# EAGLE board watchplb_mainboard_v1_0 (EAGLE 6.5.0)
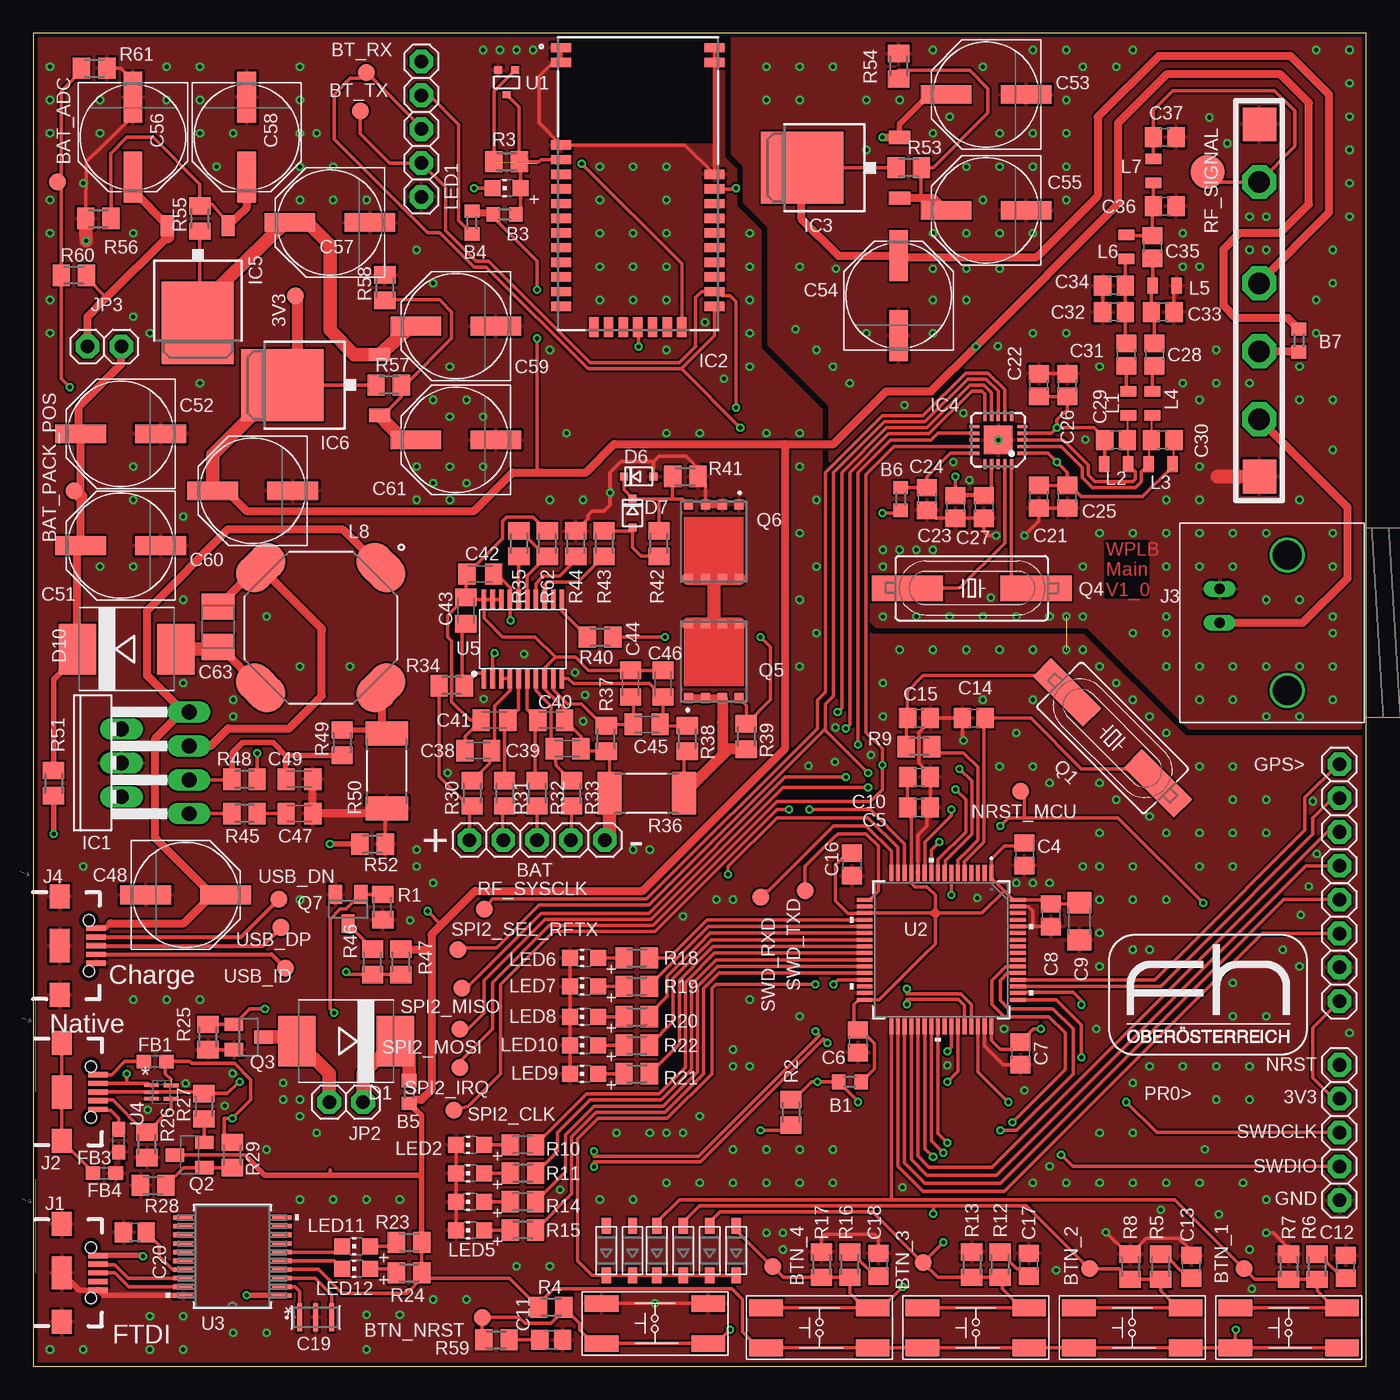
[diagram p8: board, top side]
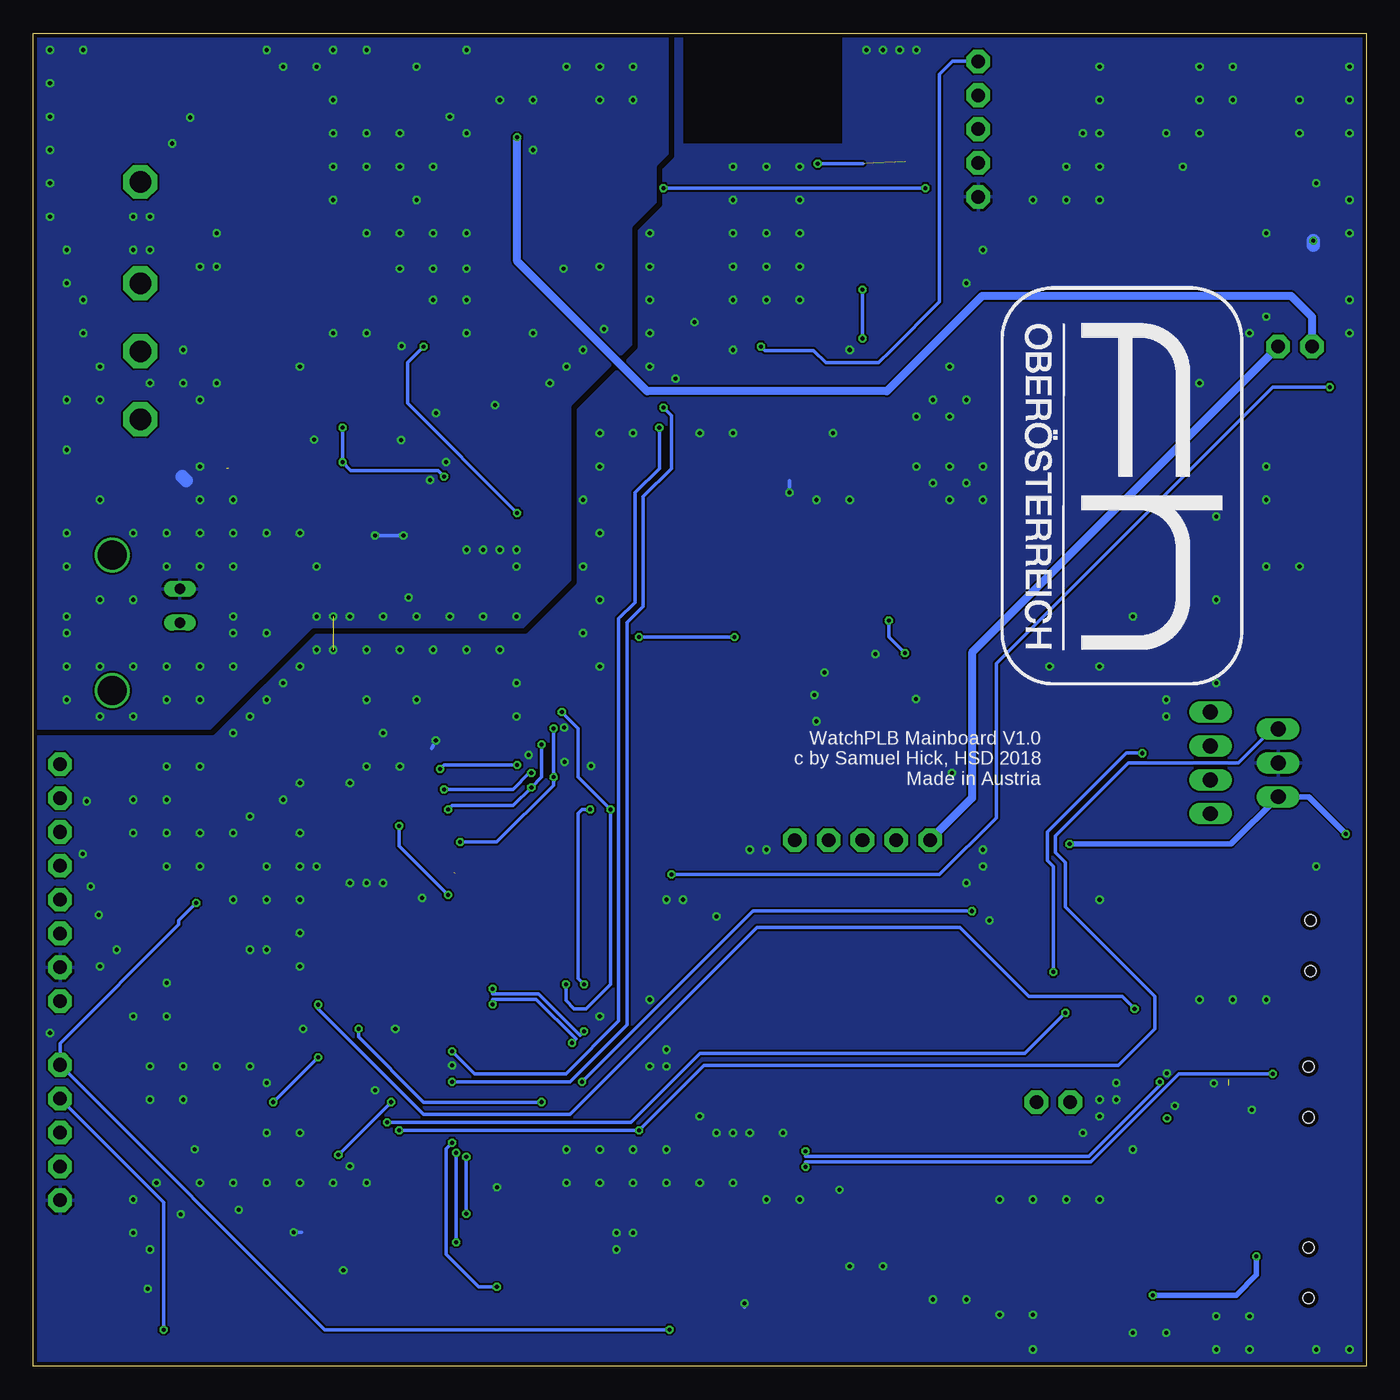
[diagram p9: board, bottom side, seen from below]

Size 100 x 100 mm. Coordinates in mm from the lower left corner, seen from the top.
Outline: 0,0 100,0 100,100 0,100 0,0
Copper layers (1*16): Top 0.035mm / dielectric 1.5mm / Bottom 0.035mm
Design rules "PCB-POOL Standard": minimum track width 0.15mm, minimum drill 0.3mm, track to track 0.15mm, track to pad 0.15mm, pad to pad 0.15mm, via to via 0.15mm, smd to smd 0.15mm, copper to edge 0.3mm, drill to drill 0.2mm, minimum pad ring 0.2mm, minimum via ring 0.15mm, stop-mask expansion 0.075mm, vias tented up to drill 0mil, thermal gap 0.2mm
tRestrict: area 39.3,91.7 to 51.2,99.7; 11 lines
bRestrict: area 39.3,91.7 to 51.2,99.7; 11 lines

## Footprints (pad centres in the part's own frame; a part is rotated, then mirrored left to right if it is on the bottom)
B1,27 = smd 1.27 x 1.27: TP 0,0
L0603 = smd 1 x 1.1: 1 -0.85,0; 2 0.85,0
1X05 = drill 1.016 pad 1.778 octagon: 1 -5.08,0; 2 -2.54,0; 3 0,0; 4 2.54,0; 5 5.08,0
C0805 = smd 1.3 x 1.5: 1 -0.85,0; 2 0.85,0
C1206 = smd 1.6 x 1.8: 1 -1.4,0; 2 1.4,0
CSTCE = smd 0.406 x 2.108: 1 -1.2,0; 2 0,0; 3 1.2,0
C0805K = smd 1.3 x 1.6: 1 -1,0; 2 1,0
PANASONIC_E = smd 3.8 x 1.4: + 3,0; - -3,0
B/3528-21R = smd 1.95 x 2.5: + 1.525,0; - -1.525,0
SMC = smd 2.8 x 3.8: A 3.7,0; C -3.7,0
SOD-123 = smd 1.2 x 0.7: A 1.85,0; C -1.85,0
SOD323-R = smd 0.6 x 0.6: A 1.1,0; C -1.1,0
0603 = smd 1.1 x 1: 1 -0.85,0; 2 0.85,0
1X08 = drill 1.016 pad 1.778 octagon: 1 -8.89,0; 2 -6.35,0; 3 -3.81,0; 4 -1.27,0; 5 1.27,0; 6 3.81,0; 7 6.35,0; 8 8.89,0
TO220-7 = drill 1.118 pad 1.626 long: 1 -3.81,-8.636; 2 -2.54,-3.556; 3 -1.27,-8.636; 4 0,-3.556; 5 1.27,-8.636; 6 2.54,-3.556; 7 3.81,-8.636
BM78SPPS5NC2_1 = smd 1.5 x 0.7: 1 -11.75,21.2; 2 -11.75,20.1; 3 -11.75,13.9; 4 -11.75,12.8; 5 -11.75,11.7; 6 -11.75,10.6; 7 -11.75,9.5; 8 -11.75,8.4; 9 -11.75,7.3; 10 -11.75,6.2; 11 -11.75,5.1; 12 -11.75,4; 13 -11.75,2.9; 14 -11.75,1.8; 22 -0.25,1.8; 23 -0.25,2.9; 24 -0.25,4; 25 -0.25,5.1; 26 -0.25,6.2; 27 -0.25,7.3; 28 -0.25,8.4; 29 -0.25,9.5; 30 -0.25,10.6; 31 -0.25,11.7; 32 -0.25,20.1; 33 -0.25,21.2 | smd 0.7 x 1.5: 15 -9.3,0.25; 16 -8.2,0.25; 17 -7.1,0.25; 18 -6,0.25; 19 -4.9,0.25; 20 -3.8,0.25; 21 -2.7,0.25
TO252 = smd 1 x 1.6: 1 -2.28,-4.8; 2 2.28,-4.8 | smd 5.4 x 6.2: TAB 0,2.5
QFN20 = smd 0.25 x 0.75: 1 -1,-1.8; 2 -0.5,-1.8; 3 0,-1.8; 4 0.5,-1.8; 5 1,-1.8; 11 1,1.8; 12 0.5,1.8; 13 0,1.8; 14 -0.5,1.8; 15 -1,1.8 | smd 0.75 x 0.25: 6 1.8,-1; 7 1.8,-0.5; 8 1.8,0; 9 1.8,0.5; 10 1.8,1; 16 -1.8,1; 17 -1.8,0.5; 18 -1.8,0; 19 -1.8,-0.5; 20 -1.8,-1 | smd 2.15 x 2.15: PAD 0,0
USB-B-MICRO-SMD = smd 1.45 x 0.4: D+ 2.725,0; D- 2.725,0.65; GND 2.725,-1.3; ID 2.725,-0.65; VBUS 2.725,1.3 | smd 1.5 x 1.8: SHIELD1 0,3.685; SHIELD2 0,-3.685 | smd 1.5 x 2.5: SHIELD3 0,0 | hole 0.85: 2.2,1.9; 2.2,-1.9
BNC = drill 2.2: 3 -5.08,5.08; 4 5.08,5.08 | drill 0.8 long: GND -2.54,0; S 0,0
1X02 = drill 1.016 pad 1.778 octagon: 1 -1.27,0; 2 1.27,0
0805 = smd 0.8 x 1.2: 1 -0.9,0; 2 0.9,0
INDM115115X635N = smd 2.769 x 4.064: 1 -6.375,0; 3 6.375,0 | smd 4.064 x 2.769: 2 0,-6.375; 4 0,6.375
CHIP-LED0805 = smd 1.2 x 1.2: A 0,-1.05; C 0,1.05
HC49UP = smd 5.334 x 1.93: 1 -4.826,0; 2 4.826,0
SOT23-BEC = smd 1 x 1.4: B -0.95,-1.1; C 0,1.1; E 0.95,-1.1
SOT23 = smd 1 x 1.4: 1 -0.95,-1.1; 2 0.95,-1.1; 3 0,1.1
TRANS_CSD18534Q5A = smd 0.75 x 0.68: 1 -2.77,1.905; 2 -2.77,0.635; 3 -2.77,-0.635; 4 -2.77,-1.905 | smd 0.66 x 0.68: 5 2.78,-1.905; 6 2.78,-0.635; 7 2.78,0.635; 8 2.78,1.905
M0805 = smd 1.3 x 1.6: 1 -0.95,0; 2 0.95,0
R2512 = smd 1.8 x 3.2: 1 -2.8,0; 2 2.8,0
B2,54 = smd 2.54 x 2.54: TP 0,0
SMD_SWITCH = smd 2.54 x 1.27: P$1 -4,1.5; P$2 4,1.5; P$3 -4,-1.5; P$4 4,-1.5
SC70-3-R = smd 0.6 x 0.55: 1 -0.65,-0.925; 2 0.65,-0.925; 3 0,0.925
LQFP64-10X10MM = smd 1.194 x 0.305: 1 -5.75,3.75; 2 -5.75,3.25; 3 -5.75,2.75; 4 -5.75,2.25; 5 -5.75,1.75; 6 -5.75,1.25; 7 -5.75,0.75; 8 -5.75,0.25; 9 -5.75,-0.25; 10 -5.75,-0.75; 11 -5.75,-1.25; 12 -5.75,-1.75; 13 -5.75,-2.25; 14 -5.75,-2.75; 15 -5.75,-3.25; 16 -5.75,-3.75; 33 5.75,-3.75; 34 5.75,-3.25; 35 5.75,-2.75; 36 5.75,-2.25; 37 5.75,-1.75; 38 5.75,-1.25; 39 5.75,-0.75; 40 5.75,-0.25; 41 5.75,0.25; 42 5.75,0.75; 43 5.75,1.25; 44 5.75,1.75; 45 5.75,2.25; 46 5.75,2.75; 47 5.75,3.25; 48 5.75,3.75 | smd 0.305 x 1.194: 17 -3.75,-5.75; 18 -3.25,-5.75; 19 -2.75,-5.75; 20 -2.25,-5.75; 21 -1.75,-5.75; 22 -1.25,-5.75; 23 -0.75,-5.75; 24 -0.25,-5.75; 25 0.25,-5.75; 26 0.75,-5.75; 27 1.25,-5.75; 28 1.75,-5.75; 29 2.25,-5.75; 30 2.75,-5.75; 31 3.25,-5.75; 32 3.75,-5.75; 49 3.75,5.75; 50 3.25,5.75; 51 2.75,5.75; 52 2.25,5.75; 53 1.75,5.75; 54 1.25,5.75; 55 0.75,5.75; 56 0.25,5.75; 57 -0.25,5.75; 58 -0.75,5.75; 59 -1.25,5.75; 60 -1.75,5.75; 61 -2.25,5.75; 62 -2.75,5.75; 63 -3.25,5.75; 64 -3.75,5.75
SSOP20_MC = smd 1.473 x 0.356: 1 -3.708,2.926; 2 -3.708,2.276; 3 -3.708,1.626; 4 -3.708,0.975; 5 -3.708,0.325; 6 -3.708,-0.325; 7 -3.708,-0.975; 8 -3.708,-1.626; 9 -3.708,-2.276; 10 -3.708,-2.926; 11 3.708,-2.926; 12 3.708,-2.276; 13 3.708,-1.626; 14 3.708,-0.975; 15 3.708,-0.325; 16 3.708,0.325; 17 3.708,0.975; 18 3.708,1.626; 19 3.708,2.276; 20 3.708,2.926
SOT50P160X60-5N = smd 1.118 x 0.254: 1 -0.737,0.508; 2 -0.737,0; 3 -0.737,-0.508 | smd 1.118 x 0.305: 4 0.737,-0.508; 5 0.737,0.508
TSSOP-20/6MM = smd 1.5 x 0.35: 1 -2.95,2.925; 2 -2.95,2.275; 3 -2.95,1.625; 4 -2.95,0.975; 5 -2.95,0.325; 6 -2.95,-0.325; 7 -2.95,-0.975; 8 -2.95,-1.625; 9 -2.95,-2.275; 10 -2.95,-2.925; 11 2.95,-2.925; 12 2.95,-2.275; 13 2.95,-1.625; 14 2.95,-0.975; 15 2.95,-0.325; 16 2.95,0.325; 17 2.95,0.975; 18 2.95,1.625; 19 2.95,2.275; 20 2.95,2.925
RA07H4047M = drill 1.6 pad 2.54 octagon: 1 6.1,1.75; 2 13.7,1.75; 3 18.8,1.75; 4 23.9,1.75 | smd 2.54 x 2.54: 5_L 1.778,1.778; 5_R 28.194,1.778

## Placement (x,y rotation side)
3V3  PTR1B1,27  [B1,27]  19.66,80.31 90 top
B1  BLM18KG601SN1D  [L0603]  61.26,21.34 0 top
B3  BLM18KG601SN1D  [L0603]  35.36,86.41 0 top
B4  BLM18KG601SN1D  [L0603]  32.92,85.8 270 top
B5  BLM18KG601SN1D  [L0603]  28.19,20.57 90 top
B6  BLM18KG601SN1D  [L0603]  65.07,65.07 90 top
B7  BLM18KG601SN1D  [L0603]  94.95,76.96 270 top
BAT  [1X05]  37.8,39.47 0 top
BAT_ADC  PTR1B1,27  [B1,27]  1.83,88.85 0 top
BAT_PACK_POS  PTR1B1,27  [B1,27]  3.05,65.68 0 top
BT_RX  PTR1B1,27  [B1,27]  24.99,97.08 0 top
BT_TX  PTR1B1,27  [B1,27]  24.54,94.18 0 top
BTN_1  PTR1B1,27  [B1,27]  90.83,7.32 180 top
BTN_2  PTR1B1,27  [B1,27]  79.25,7.32 180 top
BTN_3  PTR1B1,27  [B1,27]  66.75,7.77 180 top
BTN_4  PTR1B1,27  [B1,27]  55.47,7.47 180 top
BTN_NRST  PTR1B1,27  [B1,27]  33.68,3.66 180 top
C4  100nF  [C0805]  74.37,38.4 270 top
C5  100nF  [C0805]  66.45,41.91 180 top
C6  100nF  [C0805]  61.87,24.38 90 top
C7  100nF  [C0805]  74.07,23.47 270 top
C8  100nF  [C0805]  76.35,33.83 270 top
C9  10uF  [C1206]  78.49,33.38 270 top
C10  1uF  [C0805]  66.45,44.2 180 top
C11  100nF  [C0805]  38.86,1.98 180 top
C12  100nF  [C0805]  98.45,7.47 270 top
C13  100nF  [C0805]  86.87,7.47 270 top
C14  27p  [C0805]  70.56,48.62 180 top
C15  27p  [C0805]  66.45,48.62 0 top
C16  100nF  [C0805]  61.42,37.64 90 top
C17  100nF  [C0805]  74.68,7.62 270 top
C18  100nF  [C0805]  63.4,7.62 270 top
C19  CSTCE12M0G15L99-R0  [CSTCE]  21.18,3.66 0 top
C20  1uF  [C0805]  7.62,10.06 180 top
C21  100nF  [C0805]  75.44,65.23 90 top
C22  100nF  [C0805]  75.44,73.61 270 top
C23  100nF  [C0805]  69.19,64.47 90 top
C24  100nF  [C0805]  67.06,65.07 90 top
C25  27pF  [C0805]  77.57,65.23 90 top
C26  27pF  [C0805]  77.57,73.61 270 top
C27  1uF  [C0805]  71.32,64.47 90 top
C28  7.5pF  [C0805]  84.12,75.9 90 top
C29  2.7pF  [C0805]  81.23,69.49 180 top
C30  2.7pF  [C0805]  84.73,69.49 180 top
C31  7.5pF  [C0805]  81.99,75.9 90 top
C32  6pF  [C0805]  81.08,79.1 0 top
C33  6pF  [C0805]  84.73,79.1 0 top
C34  5.2pF  [C0805]  81.08,81.08 0 top
C35  5.2pF  [C0805]  83.97,83.97 270 top
C36  NC  [C0805]  84.89,87.02 180 top
C37  NC  [C0805]  84.89,92.2 180 top
C38  100nF  [C0805K]  33.38,46.18 180 top
C39  100nF  [C0805K]  40.08,46.33 0 top
C40  100nF  [C0805K]  38.86,48.46 0 top
C41  100nF  [C0805K]  34.59,48.46 180 top
C42  1uF  [C0805K]  33.53,59.44 0 top
C43  1uF  [C0805K]  32.46,56.69 90 top
C44  100nF  [C0805K]  44.81,51.21 270 top
C45  100nF  [C0805K]  46.02,48.16 0 top
C46  100nF  [C0805K]  47.24,51.21 90 top
C47  100nF  [C0805K]  19.96,41.45 180 top
C48  22uF 80-EDK226M050A9GAA  [PANASONIC_E]  11.43,35.36 0 top
C49  100nF  [C0805K]  19.96,44.04 180 top
C51  22uF 80-EDK226M050A9GAA  [PANASONIC_E]  6.55,61.57 180 top
C52  22uF 80-EDK226M050A9GAA  [PANASONIC_E]  6.55,69.95 180 top
C53  10uF 80-EDK106M025A9DAA  [PANASONIC_E]  71.48,95.4 180 top
C54  100uF 647-GYA1E101MCQ1GS  [PANASONIC_E]  64.92,80.31 90 top
C55  NP  [PANASONIC_E]  71.48,86.72 180 top
C56  10uF 80-EDK106M025A9DAA  [PANASONIC_E]  7.47,92.2 270 top
C57  100uF 647-GYA1E101MCQ1GS  [PANASONIC_E]  22.25,85.8 180 top
C58  NP  [PANASONIC_E]  16,92.2 270 top
C59  10uF 80-EDK106M025A9DAA  [PANASONIC_E]  31.7,78.03 180 top
C60  100uF 647-GYA1E101MCQ1GS  [PANASONIC_E]  16.46,65.68 180 top
C61  NP  [PANASONIC_E]  31.7,69.49 180 top
C63  4.7uF low esr 80-T521B475M35ATE150  [B/3528-21R]  13.87,55.47 90 top
CONFIG_INTERFACE_TEST_POINT  [1X05]  29.11,92.81 270 top
D1  S8NC-13  [SMC]  23.47,24.38 180 top
D2  [SOD-123]  46.79,8.69 90 top
D3  [SOD-123]  48.77,8.69 90 top
D4  [SOD-123]  50.75,8.69 90 top
D5  [SOD-123]  52.73,8.69 90 top
D6  Zener 16V MMSZ5246BS-7-F  [SOD323-R]  45.42,66.75 0 top
D7  100V, BAS16J,135  [SOD323-R]  44.96,64.01 270 top
D8  [SOD-123]  44.96,8.69 90 top
D9  [SOD-123]  42.98,8.69 90 top
D10  MBRS330T3  [SMC]  7.01,53.8 0 top
FB1  BLM18PG300SN1D  [0603]  9.14,22.86 0 top
FB3  BLM18PG300SN1D  [0603]  6.4,16.92 90 top
FB4  BLM18PG300SN1D  [0603]  5.33,14.48 180 top
GPS>  [1X08]  97.99,36.27 90 top
IC1  LT1513  [TO220-7]  3.05,45.26 90 top
IC2  BM70BLES1FC2-0B03AA  [BM78SPPS5NC2_1]  51.36,77.72 0 top
IC3  LM1117DTX-ADJ-12V  [TO252]  60.2,89.92 90 top
IC4  AX5031  [QFN20]  72.39,69.49 90 top
IC5  LM1117DTX-ADJ-10V  [TO252]  12.34,80.77 180 top
IC6  LM1117DTX-ADJ-3V3  [TO252]  21.18,73.61 90 top
J1  [USB-B-MICRO-SMD]  2.13,7.01 0 top
J2  [USB-B-MICRO-SMD]  2.13,20.57 0 top
J3  BNCPTH  [BNC]  89,55.78 270 top
J4  [USB-B-MICRO-SMD]  1.98,31.55 0 top
JP2  VIB_MOTOR, 619-28821  [1X02]  23.47,19.81 180 top
JP3  Power Disconnect  [1X02]  5.33,76.5 180 top
L1  39nH  [0805]  82.14,72.24 270 top
L2  120nH  [0805]  81.23,67.67 0 top
L3  120nH  [0805]  84.58,67.67 0 top
L4  39nH  [0805]  83.97,72.24 270 top
L5  27nH  [0805]  84.89,81.08 180 top
L6  27nH  [0805]  81.99,83.97 90 top
L7  0R  [0805]  84.05,89.69 90 top
L8  CTX10-4A-R  [INDM115115X635N]  21.57,55.4 225 top
LED1  BLUE  [CHIP-LED0805]  35.51,88.39 90 top
LED2  GREEN  [CHIP-LED0805]  32.77,16.61 90 top
LED3  BLUE  [CHIP-LED0805]  32.77,14.48 90 top
LED4  WHITE  [CHIP-LED0805]  32.77,12.34 90 top
LED5  RED  [CHIP-LED0805]  32.77,10.21 90 top
LED6  GREEN  [CHIP-LED0805]  41.3,30.63 90 top
LED7  GREEN  [CHIP-LED0805]  41.3,28.5 90 top
LED8  GREEN  [CHIP-LED0805]  41.3,26.21 90 top
LED9  RED  [CHIP-LED0805]  41.3,21.95 90 top
LED10  YELLOW  [CHIP-LED0805]  41.3,24.08 90 top
LED11  GREEN  [CHIP-LED0805]  24.23,8.99 90 top
LED12  RED  [CHIP-LED0805]  24.23,7.32 90 top
NRST_MCU  PTR1B1,27  [B1,27]  74.07,43.13 180 top
PR0>  SWD  [1X05]  97.99,17.53 90 top
Q1  8MHz / LFXTAL020423Reel  [HC49UP]  80.97,47.14 315 top
Q2  BC817-25SMD  [SOT23-BEC]  11.73,15.85 90 top
Q3  DMN3023L-7  [SOT23]  16.15,24.69 270 top
Q4  16MHz_LFXTAL051370Reel  [HC49UP]  70.41,58.37 180 top
Q5  CSD18534Q5A  [TRANS_CSD18534Q5A]  51.05,52.88 90 top
Q6  CSD18534Q5A  [TRANS_CSD18534Q5A]  51.05,61.87 270 top
Q7  DMN3023L-7  [SOT23]  23.62,34.29 180 top
R1  100k  [M0805]  26.21,34.44 270 top
R2  100k  [M0805]  56.85,19.05 90 top
R3  4k7  [M0805]  35.51,90.37 180 top
R4  47k  [M0805]  38.86,4.42 0 top
R5  10k  [M0805]  84.58,7.47 270 top
R6  10k  [M0805]  96.32,7.47 270 top
R7  10k  [M0805]  94.18,7.47 90 top
R8  10k  [M0805]  82.3,7.47 90 top
R9  220R  [M0805]  66.45,46.48 0 top
R10  470R  [M0805]  36.73,16.61 0 top
R11  470R  [M0805]  36.73,14.48 0 top
R12  10k  [M0805]  72.54,7.62 270 top
R13  10k  [M0805]  70.41,7.62 90 top
R14  470R  [M0805]  36.73,12.34 0 top
R15  470R  [M0805]  36.73,10.21 0 top
R16  10k  [M0805]  61.26,7.62 270 top
R17  10k  [M0805]  59.13,7.62 90 top
R18  470R  [M0805]  45.26,30.63 180 top
R19  470R  [M0805]  45.26,28.5 180 top
R20  470R  [M0805]  45.26,26.21 180 top
R21  470R  [M0805]  45.26,21.95 180 top
R22  470R  [M0805]  45.26,24.08 180 top
R23  470R  [M0805]  28.19,9.3 180 top
R24  470R  [M0805]  28.19,7.01 180 top
R25  100k  [M0805]  13.11,24.69 270 top
R26  100k  [M0805]  8.53,16.61 270 top
R27  x  [M0805]  12.8,19.51 90 top
R28  x  [M0805]  8.99,13.56 180 top
R29  x  [M0805]  14.94,15.85 270 top
R30  1k  [M0805]  32.92,42.98 90 top
R31  1k  [M0805]  35.36,42.98 90 top
R32  1k  [M0805]  37.8,42.98 90 top
R33  1k  [M0805]  40.39,42.98 90 top
R34  1k  [M0805]  31.39,51.05 0 top
R35  10k  [M0805]  36.42,61.72 90 top
R36  20mR  [R2512]  46.02,42.98 180 top
R37  100R  [M0805]  42.98,47.09 270 top
R38  100R  [M0805]  49.07,47.09 270 top
R39  10M  [M0805]  53.49,47.24 270 top
R40  5k1  [M0805]  42.52,54.71 180 top
R41  3M3  [M0805]  48.92,66.75 180 top
R42  1M  [M0805]  46.94,61.72 270 top
R43  5k1  [M0805]  42.82,61.72 90 top
R44  470k  [M0805]  40.69,61.72 90 top
R45  330  [M0805]  15.85,41.45 0 top
R46  910R  [M0805]  25.45,30.33 270 top
R47  10k  [M0805]  27.58,30.33 270 top
R48  330k  [M0805]  15.85,44.04 180 top
R49  3k9  [M0805]  23.16,46.79 90 top
R50  0.25R  [R2512]  26.52,44.65 90 top
R51  155k  [M0805]  1.52,43.74 90 top
R52  12k4  [M0805]  25.45,39.17 180 top
R53  5k1  [M0805]  65.68,89.92 0 top
R54  39k  [M0805]  64.92,97.54 90 top
R55  33k  [M0805]  12.5,86.11 90 top
R56  5k1  [M0805]  4.88,86.11 180 top
R57  8k2  [M0805]  26.67,73.61 0 top
R58  5k1  [M0805]  26.37,80.92 90 top
R59  10k  [M0805]  34.75,1.98 180 top
R60  47k  [M0805]  3.05,81.84 0 top
R61  10k  [M0805]  4.57,97.38 180 top
R62  NTC 103AT  [M0805]  38.56,61.72 90 top
RF_SIGNAL  PTR1B2,54  [B2,54]  88.09,89.61 0 top
RF_SYSCLK  PTR1B1,27  [B1,27]  33.83,34.29 180 top
S1  [SMD_SWITCH]  46.63,3.2 180 top
S2  [SMD_SWITCH]  94.18,2.9 180 top
S3  [SMD_SWITCH]  82.45,2.9 180 top
S4  [SMD_SWITCH]  70.71,2.9 180 top
S5  [SMD_SWITCH]  58.98,2.9 180 top
SPI2_CLK  PTR1B1,27  [B1,27]  31.55,19.2 180 top
SPI2_IRQ  PTR1B1,27  [B1,27]  32,22.4 180 top
SPI2_MISO  PTR1B1,27  [B1,27]  32.16,28.35 180 top
SPI2_MOSI  PTR1B1,27  [B1,27]  32,25.3 180 top
SPI2_SEL_RFTX  PTR1B1,27  [B1,27]  31.85,31.24 180 top
SWD_RXD  PTR1B1,27  [B1,27]  54.56,35.2 180 top
SWD_TXD  PTR1B1,27  [B1,27]  57.91,35.66 180 top
U1  MCP111-XXXXX/TOSMD  [SC70-3-R]  35.51,96.32 180 top
U2  STM32L073RZ  [LQFP64-10X10MM]  68.12,31.24 270 top
U3  MCP2200-I/SS  [SSOP20_MC]  14.94,8.23 180 top
U4  TPD3E001DRLR  [SOT50P160X60-5N]  9.6,20.57 0 top
U5  BQ7790504  [TSSOP-20/6MM]  36.73,54.56 90 top
U$2  RA07H4047M  [RA07H4047M]  90.22,94.95 270 top
U$4  [FH_LOGO]  27.74,81.38 270 bottom
U$5  [FH_LOGO_050]  80.47,23.16 0 top
USB_DN  PTR1B1,27  [B1,27]  18.44,35.05 90 top
USB_DP  PTR1B1,27  [B1,27]  18.59,32.92 90 top
USB_ID  PTR1B1,27  [B1,27]  18.9,29.87 90 top

## Tracks (layer width: path | path; a pad name or v marks a point on that pad's centre or on a via)
10V_INTERMEDIATE
  Top 0.254: R55.1 12.5,78.33 IC5.TAB
  Top 0.813: C57.+ 19.4,85.65 20.73,85.65
  Top 1.016: C57.+ 18.9,85.8 13.11,80.16 13.11,78.94 IC5.TAB | C59.+ 28.35,78.03 IC6.2 24.09,75.89 22.25,77.72 22.25,84.12 20.73,85.65
+3V3  (via drill 0.3)
  Top 0.254: R57.1 19.81,73.61 IC6.TAB | Q2.C 15.85,15.85 16.15,15.54 | B6.1 64.86,64.01 v63.7,64.01 | B3.1 33.16,86.41 B4.1 34.05,86.65 37.8,82.91 v37.8,80.77 | R23.1 R24.1 29.14,6.59 | U3.4 21.4,7.25 23.16,5.49 28.04,5.49 29.14,6.59 | 29.14,6.59 35.74,6.59 R4.1 37.91,4.69 39.01,5.79 52.43,5.79 53.19,5.03 53.19,2.59 54.38,1.4 S5.P$2 S5.P$1 S4.P$2 S4.P$1 S3.P$2 S3.P$1 S2.P$2 | v29.57,34.14 30.6,33.11 | v61.87,19.81 61.57,20.18 B1.1 v58.83,21.34 58.37,21.34 58.22,21.18 57.03,20 R2.2 | v37.8,77.11 37.8,67.36 38.1,67.06 | v75.59,25.3 75.05,25.3 C7.1 74,24.32 73.46,23.77 72.54,23.77 71.87,24.44 U2.48 | GPS>.1 96.01,25.4 96.01,21.64 97.59,20.07 PR0>.4 | S2.P$1 S2.P$2 | v90.22,2.74 90.18,2.71 S2.P$2 | 22.25,14.75 22.25,14.33
  Top 0.406: B5.1 29.14,18.77 29.14,14.33 | 29.14,14.33 R23.1 | 16.15,15.54 17.37,14.33 22.25,14.33 29.14,14.33
  Top 0.61: B7.1 94.12,78.64 90.22,78.64 89.31,79.55 89.31,83.82 90.53,85.04 93.57,85.04 95.71,87.17 95.71,94.79 93.57,96.93 85.04,96.93 81.38,93.27 81.38,87.17 v70.71,76.5 | v70.71,76.5 70.41,76.2 | C60.+ 13.61,65.53 14.63,65.53 16,64.16 33.07,64.16 35.97,67.06 38.1,67.06 41.45,67.06 43.59,69.19 56.39,69.19 | v70.71,76.5 67.36,73.15 64.01,73.15 60.05,69.19 56.39,69.19 | 56.39,69.19 56.39,46.33 45.72,35.66 33.15,35.66 30.6,33.11 29.87,32.38 29.87,31.24 | 29.87,31.24 29.87,20.73 29.11,19.96 28.65,19.96 28.41,19.72 B5.1 | R47.1 29.84,31.28 29.87,31.24
  Top 0.813: 3V3.TP 19.81,80.16 19.81,73.61
  Top 1.016: C60.+ 13.46,68.39 IC6.TAB
  Bottom 0.254: v63.7,64.01 71.93,72.24 71.93,75.29 v70.71,76.5 | v29.57,34.14 46.02,34.14 v58.83,21.34 | v61.87,19.81 70.71,19.81 75.59,24.69 v75.59,25.3 | v37.8,80.77 v37.8,77.11 | PR0>.4 93.57,15.65 90.22,12.29 v90.22,2.74
+12V
  Top 0.254: R53.1 IC3.TAB
  Top 0.61: 64.92,83.36 C54.+ 60.4,83.31 57.61,86.11 57.61,87.33 59.59,89.31 | 91.97,81.3 97.23,86.56 97.23,95.4 94.34,98.3 84.43,98.3 79.86,93.73 79.86,87.78 75.29,83.21 65.08,83.21 64.92,83.36 | 64.92,83.97 64.92,83.36
  Top 1.016: 59.59,89.31 58.37,89.31 IC3.TAB | U$2.2 91.97,81.3
ANT_N
  Top 0.15: L1.2 82.08,71.27 C29.1 82.13,69.44 L2.2
  Top 0.254: IC4.3 77.28,69.49 79.17,67.61 79.17,66.85 79.65,66.37 82.51,66.37 82.68,66.54 82.68,67.12 L2.2
ANT_P
  Top 0.15: L4.2 83.88,71.25 C30.2 83.68,69.29 L3.1
  Top 0.254: IC4.2 77.14,68.99 78.72,67.42 78.72,66.66 79.46,65.91 82.69,65.91 83.13,66.35 83.13,67.12 L3.1
BAT_ADC  (via drill 0.3)
  Top 0.254: 2.1,89 R60.1 2.1,74.1 v2.74,73.46 | 2.1,89 2.1,95.67 3.35,96.93 3.35,97.11 R61.2 | BAT_ADC.TP 1.95,88.85 2.1,89 | U2.15 64.87,38.91 62.64,41.15 55.78,41.15 52.12,37.49 v52.12,36.88
  Bottom 0.254: v2.74,73.46 7.01,73.46 27.74,52.73 27.74,41.15 32,36.88 v52.12,36.88
BAT_PACK_GND
  Top 0.254: 32.16,46.18 C38.2 32.38,47.24 C41.2 32.77,48.46 31.39,49.84 31.39,54.41 31.09,54.71 31.09,56.32 C43.2 | U5.20 U5.19 U5.18 | R36.2 43.23,45.89 R37.2 41.27,46.14 C39.2 41.08,47.24 C40.2 39.93,48.53 39.93,49.23 38.35,50.8 U5.8 38.35,52.37 39.17,53.19 | C46.2 C44.1 41.67,52.21 40.69,53.19 39.17,53.19 | R62.2 38.56,62.94 38.25,62.94 37.49,63.7 35.51,63.7 35.2,63.4 35.2,62.11 C42.1 32.46,59.37 C43.2 | U5.20 32.65,57.51 C43.2 | 39.17,53.19 37.64,54.71 35.2,54.71 33.8,56.11 U5.20
  Top 1.016: R36.2 43.23,39.82 BAT.5
BAT_PACK_POS
  Top 0.254: BAT.1 32.72,41.82 R30.1 32.73,42.22 32.46,42.22 30.44,44.23 R34.1
  Top 0.406: R51.2 1.52,51.51 3.05,53.03 3.05,53.53 D10.C
  Top 0.61: D10.C 3.31,61.33 | C51.+ 3.55,65.23 C52.+ | 3.4,70.15 3.4,71.98 6.6,75.18 JP3.1
  Top 1.016: 3.31,61.33 C51.+ | C52.+ 3.4,70.1 | 3.4,70.1 2.13,70.1 | 3.4,70.1 3.4,70.15 | BAT_PACK_POS.TP 3.1,65.68 3.55,65.23
  Bottom 0.61: BAT.1 29.57,42.62 29.57,53.54 JP3.1
BT_HCI_RXD  (via drill 0.3)
  Top 0.254: IC2.22 51.11,77.32 48.62,74.83 | 48.62,74.83 41.6,74.83 33.98,82.45 33.07,82.45 30.48,85.04 29.57,85.04 22.55,92.05 22.55,95.4 23.77,96.62 24.54,96.62 BT_RX.TP 29.11,92.96 CONFIG_INTERFACE_TEST_POINT.3 | 48.62,74.83 v53.03,70.41 | U2.42 68.89,25.48 68.89,23.93 v68.58,23.62
  Bottom 0.254: v53.03,70.41 53.03,67.36 54.86,65.53 54.86,57.3 56.08,56.08 56.08,25.91 60.05,21.95 66.9,21.95 v68.58,23.62
BT_HCI_TXD  (via drill 0.3)
  Top 0.254: v52.73,71.93 52.73,79.86 52.27,80.31 51.66,80.31 51.35,80.62 IC2.23 50.14,80.62 49.68,80.16 49.68,76.5 48.46,75.29 41.76,75.29 34.14,82.91 33.22,82.91 30.94,85.19 30.94,88.44 CONFIG_INTERFACE_TEST_POINT.4 26.72,90.27 24.54,92.46 BT_TX.TP | U2.43 69.37,22.13 v68.58,21.34
  Bottom 0.254: v52.73,71.93 52.12,71.32 52.12,67.36 54.25,65.23 54.25,57 55.47,55.78 55.47,25.6 59.74,21.34 v68.58,21.34
BT_NRST  (via drill 0.3)  (1 unrouted)
  Top 0.254: R3.2 34.56,93.41 34.56,95.67 34.9,96.01 35.23,96.32 U1.1 | IC2.21 48.66,82.71 v41.15,90.22
  Bottom 0.254: v41.15,90.22 37.74,90.22
BT_P2_0_MODE  (via drill 0.3)
  Top 0.254: v45.41,76.5 45.41,77.92 IC2.18
  Bottom 0.254: CONFIG_INTERFACE_TEST_POINT.1 31.04,97.89 32,96.93 32,85.65 32,79.86 35.66,76.2 36.58,75.29 40.54,75.29 41.45,76.2 45.11,76.2 v45.41,76.5
BTN_1
  Top 0.254: D2.A 46.79,10.82 48.46,12.5 64.31,12.5 | 64.31,12.5 85.65,12.5 BTN_1.TP 91.63,6.52 R7.1 R6.2 96.32,5.64 97.56,4.4 S2.P$3 S2.P$4 | U2.33 64.37,12.56 64.31,12.5
BTN_2  (via drill 0.3)
  Top 0.254: D3.A 48.77,10.82 49.99,12.04 67.51,12.04 | 67.51,12.04 74.52,12.04 BTN_2.TP 81.5,7.32 R8.1 R5.2 84.58,5.64 85.83,4.4 S3.P$3 S3.P$4 | U2.38 66.9,25.46 66.9,16.31 v67.51,15.7 | v67.51,11.43 67.51,12.04
  Bottom 0.254: v67.51,15.7 v67.51,11.43
BTN_3  (via drill 0.3)
  Top 0.254: BTN_3.TP 67.85,6.67 R13.1 R12.2 72.69,6.52 72.69,5.79 74.09,4.4 S4.P$3 S4.P$4 | 50.77,10.54 D4.A 50.9,10.69 50.9,10.97 51.51,11.58 62.94,11.58 BTN_3.TP | U2.39 67.37,16.9 v68.28,16 | v68.28,9.3 BTN_3.TP
  Bottom 0.254: v68.28,16 v68.28,9.3
BTN_4  (via drill 0.3)
  Top 0.254: D5.A 52.73,10.21 BTN_4.TP 56.27,6.67 R17.1 R16.2 61.27,5.79 61.27,5.49 61.42,5.33 62.36,4.4 S5.P$3 | U2.40 67.87,17.47 v68.58,16.76 | S5.P$3 63.68,4.4 v65.23,5.94 | S5.P$4 S5.P$3
  Bottom 0.254: v68.58,16.76 69.04,16.31 69.04,8.38 66.6,5.94 v65.23,5.94
CHARGER_CH_PRECH  (via drill 0.3)
  Top 0.254: U2.54 72.97,29.99 71.93,28.96 71.93,27.13 72.85,26.21 76.2,26.21 77.42,24.99 77.42,22.25 v73.46,18.29 | v22.55,26.52 22.25,26.82 22.25,32.16 22.25,33.53 23.01,34.29 23.47,34.29 Q7.1 R1.1
  Bottom 0.254: v22.55,26.52 25.6,23.47 49.68,23.47 49.99,23.47 55.17,18.29 v73.46,18.29
CHARGER_SS  (via drill 0.3)
  Top 0.254: U2.53 73.08,29.49 72.54,28.96 72.54,27.43 73.15,26.82 76.5,26.82 78.03,25.3 78.03,21.95 73.76,17.68 v72.54,17.68 | R2.1 56.42,17.68 v54.56,17.68
  Bottom 0.254: IC1.6 7.06,47.8 9.6,45.26 17.83,45.26 23.32,39.78 23.32,38.56 22.55,37.8 22.55,34.44 15.85,27.74 15.85,25.3 18.59,22.55 49.68,22.55 v54.56,17.68 v72.54,17.68
GND  (via drill 0.3)  (1 unrouted)
  Top 0.254: R56.2 3.96,90.37 7.47,93.73 C56.- 7.01,95.66 7.01,96.93 6.55,97.38 R61.1 | C59.- 33.38,78.03 | 39.99,1.7 C11.1 | C13.1 86.87,8.69 85.95,9.6 83.52,9.6 82.33,8.42 R8.2 82.11,8.42 v80.47,10.06 | R25.2 Q3.2 | Q6.3 50.42,66.2 R41.1 50.17,67.05 48.95,68.28 46.94,68.28 46.52,67.85 | R44.2 41.6,63.59 41.6,63.86 41.91,64.16 42.82,64.16 43.28,64.62 v43.28,65.53 43.28,67.06 44.08,67.85 46.52,67.85 | R52.1 26.4,41.17 26.12,41.45 | C26.1 C22.1 | v74.37,62.33 75.44,63.4 C21.1 C25.1 | 85.48,79.5 C33.2 85.58,80.87 L5.1 | C34.1 C32.1 | 46.52,67.85 D6.A | 26.36,81.84 R58.2 | IC2.1 IC2.2 39.59,97.84 39.01,97.84 37.95,96.77 37.95,93.28 IC2.3 48.91,91.62 IC2.31 IC2.32 IC2.33 | 21.18,2.9 C19.2 | U2.60 74.98,32.99 | 74.98,32.99 76.34,32.99 C8.2 | U2.63 74.63,34.49 74.98,34.14 74.98,32.99 | C7.2 72.78,22.62 71.37,24.03 U2.47 | U2.12 66.37,39.85 67.06,40.54 67.06,41.06 C5.1 67.3,44.41 66.45,45.26 66.45,47.55 66.9,48.01 66.9,48.22 C15.2 C14.2 69.71,47.03 v69.8,46.94 | LED9.C LED10.C LED8.C LED7.C LED6.C | LED2.C LED3.C LED4.C LED5.C | R7.2 94.18,8.84 93.02,10 v92.5,10 | U4.3 8.48,20.07 | C18.1 63.4,9.6 63.09,9.91 59.44,9.91 59.13,9.6 R17.2 | C24.1 67.67,63.62 C23.1 C27.1 71.32,62.64 71.63,62.33 v72.24,62.33 | S1.P$3 46.66,4.7 v46.63,4.72 46.61,4.7 S1.P$4
  Top 0.406: J1.SHIELD3 3.43,5.71 J1.GND 5.26,5.3 U3.20
  Top 0.61: Q6.2 Q6.3 | C49.1 C47.1 26.12,41.45 | C52.- 10.52,69.95
  Top 1.016: 8.84,61.57 C51.- | R50.1 26.12,41.45 | U$2.5_R 88.85,66.75 | R56.2 3.93,85.08 v3.96,84.43
  Bottom 0.254: v72.24,62.33 v74.37,62.33 | v69.8,46.94 70.1,46.33 | v80.47,10.06 79.86,10.06 | v43.28,65.53 43.28,66.45 | v46.63,4.72 46.63,4.42
  Bottom 1.016: 88.85,66.75 88.54,66.45 | v3.96,84.43 3.96,84.12
  other vias: 72.39,69.49 84.58,11.73 88.93,11.4 90.76,13.75 87.5,13.75 85,13.75 82.5,13.75 80,13.75 77.5,13.75 76.25,15 75,13.75 91.25,8.75 92.5,12.5 80,17.5 82.5,17.5 87.9,16.28 88.75,20 88.75,22.5 86.25,22.5 83.75,22.5 82.5,21.25 91.25,20 91.25,22.5 98.75,25 80,30 82.5,31.25 83.75,31.25 93.75,31.25 92.5,26.25 90,26.25 90,28.75 95,30 80,32.5 85,35 82.5,35 80,35 82.5,37.5 80,40 80,37.5 78.75,37.5 76.25,36.25 75,36.25 73.75,36.25 90,45 90,42.5 92.5,42.5 90,40 92.5,40 90,37.5 87.5,37.5 85,40 87.5,40 87.5,45 85,47.5 83.75,48.75 82.5,50 81.25,51.25 80,52.5 78.75,53.75 77.5,53.75 75,53.75 75,50 71.25,50 73.75,47.5 72.5,45 75,45 76.25,43.75 80,43.75 81.25,42.5 83.75,41.25 72.5,53.75 70,53.75 67.5,53.75 65,53.75 63.75,51.25 63.75,48.75 97.5,56.25 97.5,55 97.5,52.5 97.5,50 95,48.75 92.5,48.75 85,55 85,52.5 92.5,52.5 95,52.5 82.5,55 77.5,56.25 78.75,56.25 85,56.25 85,60 87.5,60 90,60 92.5,57.5 95,57.5 97.5,60 97.5,62.5 95,65 92.5,62.5 90,62.5 85,62.5 87.5,62.5 82.5,62.5 80,62.5 78.75,60 85,65 87.5,65 87.5,67.5 90,50 90,52.5 87.5,50 87.5,52.5 76.25,56.25 73.75,56.25 71.25,56.25 71.83,57.68 68.75,56.25 66.25,56.25 63.75,56.25 63.75,60 63.75,61.25 67.5,61.25 66.25,61.25 65,61.25 87.5,72.5 88.75,73.75 86.25,73.75 97.5,68.75 97.5,72.5 96.25,77.5 96.25,80 97.5,81.25 97.5,83.75 95,75 95,72.5 91.25,73.75 88.75,76.25 87.5,82.5 86.25,82.5 86.25,85 91.25,86.25 92.5,86.25 92.5,83.75 91.25,83.75 98.75,86.25 98.75,88.75 98.75,91.25 98.75,93.75 98.75,96.25 98.75,98.75 96.25,98.75 82.5,98.75 77.5,98.75 78.75,97.5 81.25,97.5 77.5,95 77.5,90 77.5,92.5 77.5,87.5 75,98.75 71.25,97.5 67.5,98.75 71.25,87.5 70,90 75,92.5 75,90 72.5,92.5 72.5,90 70,85 75,85 72.5,85 67.5,85 70,82.35 72.5,82.35 70,80 67.5,77.5 67.5,80 67.5,82.35 60.21,82.35 62.5,77.5 61.25,73.75 60,75 58.75,76.25 57.2,77.8 57.5,82.5 60,97.5 57.5,95 57.5,97.5 55,97.5 55,95 62.5,95 65,95 67.5,92.5 68.75,93.75 62.5,91.25 53.75,85 53.75,82.5 53.75,80 53.75,77.5 53.75,75 55,70 57.5,70 57.5,67.5 58.75,65 57.5,62.5 58.75,60 57.5,57.5 58.75,55 57.5,52.5 75,77.5 77.5,77.5 80,75 50,70 47.5,70 40,70 38.75,76.25 47.5,76.25 47.5,80 45,80 42.5,80 42.5,87.5 42.5,85 42.5,82.5 47.5,82.5 45,82.5 45,85 47.5,87.5 47.5,85 47.5,90 45,90 42.5,90 37.5,98.75 36.25,98.75 35,98.75 33.75,98.75 20,97.5 20,95 20,92.5 21.25,92.5 22.5,90 25,87.5 22.5,87.5 20,87.5 20,90 15,92.5 13.75,90 12.5,97.5 12.5,95 12.5,92.5 10,97.5 10,95 1.25,97.5 5,95 5,92.5 3.75,88.75 1.25,95 1.25,92.5 1.25,87.5 1.25,85 7.5,85 7.5,78.75 8.75,77.5 1.25,77.5 1.25,80 7.5,67.5 7.5,65 7.5,60 5,60 12.5,73.75 60,16.25 60,13.75 57.5,16.25 57.5,13.75 55,16.25 55,13.75 52.5,16.25 52.5,13.75 50,13.75 47.5,13.75 42.5,12.5 45,12.5 56.25,10 56.25,8.75 55,10 38.75,7.5 36.25,7.5 32.5,5 30,5 27.5,3.87 25,3.87 25,1.25 17.5,2.5 15,2.5 11.25,3.75 8.75,3.75 11.25,1.25 8.75,1.25 3.75,1.25 1.25,1.25 20,12.5 22.5,12.5 25,12.5 27.5,12.5 17.5,16.25 18.75,20 18.75,21.25 20,20 20,18.75 21.25,17.5 7.5,27.5 10,27.5 12.5,27.5 3.75,37.5 20,35 28.75,37.5 30,36.25 28.26,33.45 28.75,38.75 38.75,65 41.25,65 28.75,65 33.75,67.5 32.5,66.25 31.25,65 30,66.25 31.25,67.5 28.75,67.5 33.75,71.25 31.25,71.25 30,72.5 32.5,72.5 31.25,75 28.75,83.75 30,81.25 15,48.75 15,50 11.25,51.25 20,52.5 11.25,57.5 17.5,56.25 23.75,52.5 11.25,63.75 43.75,17.5 39.51,13.23 46.25,17.5 47.5,17.5 48.75,17.5 50,18.75 53.75,22.5 52.5,23.75 52.5,22.5 53.75,27.5 57.5,26.25 52.5,35 51.25,35 48.75,33.75 46.25,38.75 45,38.75 8.57,19.24 11.43,21.22 14.94,21.98 76.74,7.2 74.36,20.7 88.23,93.69 89.57,91.74 14.36,19.54 36.83,53.42 58.17,45.04 60.15,45.34 70.82,35.13 33.78,50.06 41.4,50.37 41.25,48.39 40.64,52.05 79.76,25.31 91.43,5.79 72.38,76.52 78.93,69.51 70.25,66.47 69.03,67.84 69.79,71.49 65.37,72.1 51.81,74.09 95.09,33.85 95.7,35.99 96.31,38.42 96,42.39 65.22,13.43 68.57,22.57 72.84,25.32 31.08,44.52 62.84,45.85 60.17,47.91 50.4,78.32
  pour Bottom: 0,100 100,100 100.61,0 0,0
  pour Top: 0,100 100,100 101.52,-0.15 0.3,0
GPS_EXTINT
  Top 0.254: GPS>.5 95.45,37.54 72.24,14.33 67.06,14.33 65.87,15.51 U2.36
GPS_NRESET
  Top 0.254: GPS>.6 97.08,40.08 71.93,14.94 67.21,14.94 66.37,15.77 U2.37
GPS_RXD
  Top 0.254: U2.51 84.58,28.49 87.17,31.09 96.01,39.93 96.01,41.15 97.48,42.62 GPS>.7
GPS_SCL
  Top 0.254: GPS>.3 92.2,32.46 72.85,13.11 66.75,13.11 64.87,14.98 U2.34
GPS_SDA
  Top 0.254: GPS>.4 93.83,35 72.54,13.72 66.9,13.72 65.37,15.25 U2.35
GPS_TXD
  Top 0.254: U2.52 84.16,28.99 86.56,31.39 95.4,40.23 95.4,42.67 97.89,45.16 GPS>.8
IND_LED_B
  Top 0.254: U2.26 51.22,30.49 49.68,28.96 49.38,28.65 49.38,24.38 49.38,22.25 47.24,20.12 47.09,19.96 41.76,19.96 39.32,17.53 39.32,16.12 R11.2
IND_LED_G
  Top 0.254: U2.25 51.11,30.99 49.07,28.96 48.92,28.8 48.92,24.38 48.92,22.4 46.94,20.42 41.49,20.42 R10.2
IND_LED_R
  Top 0.254: U2.28 51.44,29.49 50.29,28.35 50.29,24.38 50.29,22.1 50.29,21.95 47.4,19.05 42.22,19.05 40.39,17.22 40.39,12.92 R15.2
IND_LED_W
  Top 0.254: U2.27 51.33,29.99 49.99,28.65 49.84,28.5 49.84,24.38 49.84,22.1 47.55,19.81 47.24,19.51 42.06,19.51 39.93,17.37 39.93,14.6 R14.2
INT_POWER  (via drill 0.3)  (1 unrouted)
  Top 0.15: L3.2 85.58,67.77 C30.1 | C29.2 80.33,69.44
  Top 0.254: C23.2 C27.2 71.89,65.88 IC4.17 71.89,65.64 71.63,65.38 69.34,65.38 69.19,65.53 v69.19,66.75 | C26.2 C22.2 | C25.2 C21.2 | 85.34,69.1 C30.1 | L3.2 85.48,67.35 | C25.2 77.79,66.08 78.64,65.23 83.21,65.23 85.34,67.36 | 77.57,72.69 C26.2 | IC4.1 76.13,68.49 v76.81,67.82 77.57,67.06 C25.2 | v76.81,70.41 76.39,69.99 IC4.4 | 80.33,69.44 79.86,69.92 79.86,70.1 79.55,70.41 v76.81,70.41 | L2.1 80.38,67.72 C29.2 | v76.81,70.41 76.81,71.02 77.57,71.78 C26.2
  Bottom 0.254: v76.81,70.41 v76.81,67.82 76.2,67.21 69.65,67.21 v69.19,66.75
MCU_WAKEUP  (via drill 0.3)
  Top 0.254: D9.C D8.C D2.C D3.C D4.C D5.C 41.93,6.84 40.84,7.92 40.84,17.07 42.37,18.59 47.55,18.59 50.9,21.95 50.9,28.35 51.21,28.65 v58.67,28.65 | U2.14 65.37,39.17 62.79,41.76 v58.22,41.76
  Bottom 0.254: v58.67,28.65 59.13,29.11 59.13,41.45 58.83,41.76 v58.22,41.76
N$1
  Top 0.254: LED2.A R10.1
N$2
  Top 0.254: C12.2 98.23,6.62 96.93,7.92 96.81,7.92 R6.1
N$3  (via drill 0.3)
  Top 0.254: LED1.C v33.07,88.39 | v52.73,88.39 52.66,88.32 IC2.30
  Bottom 0.254: v33.07,88.39 v52.73,88.39
N$4
  Top 0.254: LED3.A R11.1
N$5
  Top 0.254: Q1.1 76.29,51.82 66.75,51.82 65.53,50.6 65.6,50.53 C15.1 65.5,48.52 R9.1
N$6
  Top 0.254: U2.5 69.87,37.87 71.32,39.32 71.32,48.53 C14.1 74.83,48.62 78.64,44.81 83.3,44.81 Q1.2
N$7
  Top 0.254: R5.1 84.85,8.42 86.41,6.86 86.63,6.86 C13.2
N$8
  Top 0.254: R23.2 26.94,8.99 LED11.A
N$9
  Top 0.254: R9.2 67.55,46.02 69.8,46.02 70.87,44.96 70.87,40.08 70.87,39.47 70.1,38.71 69.37,37.98 U2.6
N$10
  Top 0.254: U3.3 21.13,6.6 22.25,5.49 22.38,5.35 C19.3
N$11
  Top 0.254: R12.1 73.8,7.32 74.07,7.32 74.61,6.77 C17.2
N$12
  Top 0.254: LED4.A R14.1
N$13
  Top 0.254: LED9.A R21.2
N$15
  Top 0.254: U3.2 18.65,5.94 19.66,5.94 19.98,5.62 C19.1
N$16
  Top 0.254: LED5.A R15.1
N$17
  Top 0.254: J1.D- 4.9,7.62 6.1,7.62 7.11,6.6 U3.18
N$18
  Top 0.254: C18.2 62.85,7.32 62.64,7.32 61.38,8.57 R16.1
N$19
  Top 0.254: LED6.A R18.2
N$20
  Top 0.254: J1.D+ 6.1,7.01 7.15,5.95 U3.19
N$21
  Top 0.254: 9.08,9.45 C20.1 9.45,9.08 9.45,8.23 10.42,7.25 U3.17
N$22
  Top 0.254: LED7.A R19.2
N$23
  Top 0.254: R24.2 26.94,7.32 LED12.A
N$24
  Top 0.254: LED10.A R22.2
N$25
  Top 0.254: LED8.A R20.2
N$26
  Top 0.254: 23.05,8.86 LED11.C 22.75,8.55 U3.6
N$27
  Top 0.254: U3.5 18.66,7.92 21.34,7.92 22.57,7.92 LED12.C
N$28
  Top 1.016: Q3.3 19.46,24.69 D1.A 22.2,21.95 JP2.2
N$29
  Top 0.254: J2.SHIELD1 J2.SHIELD3 J2.SHIELD2 4.48,14.54 FB4.2
N$30
  Top 0.254: J2.GND 4.93,19.2 5.79,19.2 6.4,18.59 FB3.2
N$31
  Top 0.254: J2.VBUS 5.87,21.87 6.86,22.86 FB1.1
N$32
  Top 0.254: J2.ID 4.9,19.96 5.94,19.96 8.35,17.56 R26.1 10.34,19.36 U4.4 10.01,20.07
N$33
  Top 0.254: IC4.19 72.89,61.77 69.49,58.37 Q4.2
N$34
  Top 0.254: IC4.20 73.39,58.89 73.61,58.67 | 73.15,58.67 73.61,58.67 | 73.61,58.67 74.93,58.67 Q4.1
N$35
  Top 0.254: Q2.E 12.8,16.83 R27.1
N$36
  Top 0.254: R28.1 11.28,14.9 Q2.B R29.2
N$37
  Top 0.254: RF_SYSCLK.TP 34.44,35.05 46.02,35.05 58.83,47.85 58.83,49.99 59.44,50.6 59.44,67.06 63.7,71.32 66.75,71.32 69.95,74.52 71.63,74.52 72.89,73.26 IC4.7
N$38
  Top 0.254: U5.15 37.05,59.27 R62.1 38.44,60.77 36.88,62.33 36.76,62.33 R35.2
N$39
  Top 0.254: L4.1 83.97,74.89 C28.1
N$40
  Top 0.254: 81.84,74.89 C31.1 81.99,73.29 L1.1
N$41  (via drill 0.3)
  Top 0.254: U3.1 18.61,5.33
  Top 0.406: 18.61,5.33 v16,5.33 | v8.23,8.23 8.15,8.31 J1.VBUS
  Bottom 0.406: v16,5.33 9.75,5.33 8.23,6.86 v8.23,8.23
N$42
  Top 0.254: L6.1 81.93,83.01 C34.2 C32.2 81.93,76.99 C31.2
N$43
  Top 0.254: C35.2 83.99,83.11 L5.2 83.88,80.97 C33.1 84.12,78.86 C28.2
N$44  (via drill 0.3)  (1 unrouted)
  Top 0.254: R29.1 14.33,17.41 14.33,18.59 v14.94,18.59 16.31,19.96 16.31,21.49 15.09,22.71 11.89,22.71 11.73,22.86 FB1.2 9.91,22.77 9.91,21.95 10.34,21.51
N$45
  Top 0.254: 83.92,84.87 C35.1 | L7.1 84.04,88.78 C36.2 83.97,86.96 C35.1 | L6.2 82.04,84.82 C35.1
N$46
  Top 0.254: R41.2 47.97,65.11 48.01,65.08 | D6.C 44.31,65.75 D7.C 44.99,65.08 46.94,65.08 | R42.1 46.94,65.08 | 46.94,65.08 48.01,65.08 | 48.01,65.08 48.72,65.08 Q6.4
N$47
  Top 0.254: BAT.2 35.2,39.42 35.2,41.87 R31.1
N$48
  Top 0.254: BAT.3 R32.1
N$49
  Top 0.254: BAT.4 40.39,39.42 R33.1
N$50
  Top 0.254: R33.2 39.23,45.08 C39.1 38.86,46.55 38.86,49.53 38.25,50.14 37.7,50.69 U5.7
N$51
  Top 0.254: U5.6 37.05,49.27 C40.1 37.64,48.09 37.64,44.08 R32.2
N$52
  Top 0.254: 35.81,48.09 C41.1 | U5.5 36.4,49.27 C41.1 | R31.2 35.36,48.23 C41.1
N$53
  Top 0.254: R30.2 34.23,45.23 C38.1 34.59,46.4 34.59,47.09 34.59,49.53 35.75,50.69 U5.4 U5.3
N$54
  Top 0.254: U5.1 33.8,52 33.29,52 R34.2 32.16,51.24 32.16,55.39 C43.1
N$55
  Top 0.254: R36.1 48.83,45.89 R38.2
  Top 0.61: Q5.1 Q5.2 Q5.3
  Top 0.813: Q5.3 51.69,48.31 51.69,45.84 | 51.69,45.84 R36.1 | R39.2 52.14,46.29 51.69,45.84
N$56  (via drill 0.3)
  Top 0.254: C42.2 34.75,59.44 35.81,58.37 35.81,57.57 U5.17 35.75,55.99 v35.81,55.93 | v34.59,53.49 34.45,53.35 U5.2
  Bottom 0.254: v35.81,55.93 35.81,54.71 v34.59,53.49
N$57
  Top 0.254: R38.1 46.99,48.04 C45.2 47.24,48.53 C46.1 46.24,51.21 40.54,51.21 40.14,51.61 U5.10 39.65,51.21
N$58
  Top 0.254: 45.17,49.99 C44.2 45.02,49.99 C45.1 43.09,48.16 R37.1 42.79,48.04 41.15,49.68 40.08,49.68 39,50.76 U5.9
N$59
  Top 1.016: Q5.8 Q5.7 51.05,55.66 | 51.05,55.66 Q5.6 Q5.5 | Q6.5 Q6.6 Q6.7 Q6.8 51.05,59.09 51.05,55.66
N$60
  Top 0.254: U5.16 36.42,57.53 R35.1
N$61
  Top 0.61: 16.78,59.91 C63.+ | L8.2 21.64,55.33 21.64,55.17 21.64,50.29 19.2,47.85 14.63,47.85 13.31,46.53 IC1.5
  Top 1.016: L8.2 16.78,59.91
N$62  (via drill 0.3)
  Top 0.254: R40.1 v47.4,54.71 | v54.56,54.71 55.32,53.95 55.32,50.02 R39.1 53.49,49.58 Q5.4
  Bottom 0.254: v47.4,54.71 v54.56,54.71
N$63
  Top 0.254: U5.11 39.65,56.63 R40.2
N$64
  Top 0.254: R43.2 44.72,62.67 D7.A 44.96,61.42 45.6,60.77 R42.2
N$65
  Top 0.254: U5.13 38.35,58.62 38.56,58.83 40.88,58.83 R43.1
N$66
  Top 0.254: U5.14 37.7,58.73 38.25,59.28 39.47,59.28 40.39,60.2 40.39,60.47 R44.1
N$69
  Top 0.406: J4.VBUS 4.78,32.92 5.49,32.92 5.79,33.22
  Top 0.61: L8.1 23.2,62.79 14.63,62.79 8.53,56.69 8.53,51.82 11.12,49.23 11.12,49.07 | 5.79,33.22 11.28,33.22 13.11,35.05 14.12,35.05 C48.+ 13.41,35.36 9.14,39.62 9.14,47.09 11.12,49.07 | 11.12,49.07 IC1.7
N$70
  Top 0.406: R49.2 26.1,47.74 26.16,47.81
  Top 0.61: 26.08,50.43 L8.4 26.16,50.81 26.16,47.81 | 26.52,49.99 25.6,49.99
  Top 1.016: 26.08,50.43 26.52,49.99 | 25.6,49.99 25.3,50.29 | 26.16,47.81 R50.2
N$71
  Top 0.254: R45.2 C47.2
N$72
  Top 0.254: R45.1 IC1.1
N$73
  Top 0.254: R46.1 Q7.3
N$74  (via drill 0.3)
  Top 0.254: 16.76,46.02 v16.8,45.99 R48.1 | R47.2 R46.2 23.66,29.38 v23.47,29.57
  Bottom 0.254: v23.47,29.57 23.47,37.49 23.93,37.95 23.93,40.08 17.98,46.02 16.84,46.02 v16.8,45.99
N$76
  Top 0.254: R48.2 14.9,43.99 IC1.3
  Top 0.406: 19.36,44.65 19.36,44.43 C49.2 18.93,44.08 18.93,45.84 | R49.1 18.93,45.84 | 18.93,45.84 17.98,46.79 15.7,46.79 14.94,46.02 14.94,44.08 R48.2
N$77  (via drill 0.3)
  Top 0.406: v1.52,39.93 R51.1 | R52.2 v22.25,39.17
  Bottom 0.406: v1.52,39.93 4.32,42.72 IC1.2 10.16,39.17 v22.25,39.17
N$78
  Top 0.254: B4.2 31.92,85.95 31.92,93.15 29.72,95.35 CONFIG_INTERFACE_TEST_POINT.2
N$80
  Top 0.254: R3.1 36.56,90.27 LED1.A 36.56,86.76 B3.2 | R3.1 36.46,94.05 36.46,94.44 U1.3 | IC2.4 38.1,90.52 37.95,90.37 R3.1
N$81
  Top 1.016: JP2.1 24.74,21.95 D1.C 28.19,23.36 B5.2
N$82
  Top 0.254: B6.2 C24.2 67.06,66.75 67.97,67.67 68.8,68.49 69.63,68.49 IC4.15
N$83
  Top 0.61: U$2.3 94.91,76.14 B7.2
N$84  (via drill 0.3)
  Top 0.254: R60.2 4,81.65 5.49,80.16
  Top 0.406: C53.+ 67.21,95.4 65,93.19 IC3.2
  Top 0.61: 7.47,88.24 IC5.2 | JP3.2 4.06,78.74 5.49,80.16 10.06,84.74 | v63.7,92.2 IC3.2
  Top 1.016: C56.+ 7.47,88.24 | 10.06,84.74 IC5.2
  Bottom 0.61: JP3.2 4.06,78.74 5.64,80.31 28.8,80.31 35.97,73.15 53.95,73.15 63.7,82.91 v63.7,92.2
N$85
  Top 0.254: R54.1 64.92,97.23 70.26,97.23 71.63,95.86 71.63,94.03 67.51,89.92 R53.2 66.6,89.92 66.6,87.64
  Top 0.61: C55.+ 67.56,87.64 66.6,87.64 IC3.1
N$86
  Top 0.254: C11.2 R59.1
N$87
  Top 0.305: J4.ID 17.87,30.9 USB_ID.TP
N$88
  Top 0.305: J4.D+ 17.22,31.55 USB_DP.TP
N$89
  Top 0.254: IC5.1 14.33,85.8 14.33,86.11 13.41,87.17 R55.2 12.5,88.7 8.99,92.2 7.01,92.2 5.79,90.98 R56.1 5.79,86.26
  Top 0.61: C58.+ 16,86.87 IC5.1
N$90
  Top 0.305: J4.D- 15.59,32.2 USB_DN.TP
N$91
  Top 0.61: L8.3 14.01,53.95
  Top 1.016: D10.A 10.71,53.94 | 10.67,54.86 10.67,53.84 D10.A | 14.01,53.95 C63.- 13.41,53.95 13.26,53.8 D10.A
N$92
  Top 0.254: IC6.1 26.52,71.78 26.67,71.78 27.58,72.69 R57.2 27.89,73.61 31.39,77.11 31.39,79.1 30.48,80.01 26.36,80.01 R58.1
  Top 1.016: C61.+ 27.74,69.49 IC6.1
NRST  (via drill 0.3)
  Top 0.254: 40.09,4.7 R4.2 | U2.7 68.89,36.98 v68.89,35.36 | v72.54,40.54 73.15,41.15 74.37,41.15 | 74.37,41.15 81.38,41.15 v87.78,34.75 | 74.37,41.15 74.37,42.82 NRST_MCU.TP | R59.2 33.68,2.1 BTN_NRST.TP | 33.98,3.2 BTN_NRST.TP | R4.2 41,3.24 41,2.74 42.04,1.7 S1.P$2 S1.P$1 51.23,1.7 51.97,2.44 v52.27,2.74 | R4.2 39.81,4.15 38.86,3.2 36.88,3.2 36.42,3.66 BTN_NRST.TP
  Bottom 0.254: v68.89,35.36 72.54,39.01 v72.54,40.54 | v87.78,34.75 89.09,33.44 89.09,33.14 97.99,24.23 PR0>.5 78.13,2.74 v52.27,2.74
POW_LED_G1
  Top 0.254: U2.22 50.78,32.49 49.99,31.7 47.55,29.26 47.55,27.74 46.21,26.4 R20.1
POW_LED_G2
  Top 0.254: U2.21 50.67,32.99 49.68,32 47.55,29.87 46.21,28.53 R19.1
POW_LED_G3
  Top 0.254: U2.20 50.56,33.49 49.38,32.31 47.7,30.63 R18.1
POW_LED_R
  Top 0.254: U2.24 51,31.49 50.6,31.09 48.46,28.96 48.46,24.2 R21.1
POW_LED_Y
  Top 0.254: U2.23 50.89,31.99 50.29,31.39 48.01,29.11 48.01,26.52 48.01,25.87 R22.1
RF_SIGNAL
  Top 0.254: C37.2 84.04,92.42 | RF_SIGNAL.TP 88.85,88.84 U$2.1 94.64,91.52 94.64,94.18 93.12,95.71 85.5,95.71 84.04,94.25 C37.2 | L7.2 84.04,90.6 C37.2
RF_SIGNAL_AMPLIFIED
  Top 0.61: J3.S 95.25,55.78 98.6,59.13 98.6,64.41 U$2.4
SPI2_CLK  (via drill 0.3)
  Top 0.254: v60.35,49.07 60.66,49.38 60.66,67.06 64.01,70.41 67.06,70.41 70.26,73.61 71.32,73.61 71.89,73.04 IC4.9 | v60.05,28.65 60.39,28.99 U2.29 | SPI2_CLK.TP 32.61,19.51 35.05,21.95 35.05,28.65 39.01,32.61 46.63,32.61 55.78,41.76 v56.69,41.76
  Bottom 0.254: v60.35,49.07 59.13,47.85 59.13,44.2 v56.69,41.76 56.69,28.65 58.52,26.82 59.44,26.82 60.05,27.43 v60.05,28.65
SPI2_IRQ  (via drill 0.3)  (1 unrouted)
  Top 0.254: v69.49,44.81 70.41,43.89 70.41,39.93 68.43,37.95 68.43,37.05 | SPI2_IRQ.TP 32,22.86 34.44,25.3 34.44,28.8 38.71,33.07 46.48,33.07 55.78,42.37 62.79,42.37 63.7,43.28 v63.7,45.11 63.7,46.33 62.48,47.55 62.48,66.9 64.58,68.99 IC4.14
  Bottom 0.254: v63.7,45.11 69.19,45.11 v69.49,44.81
SPI2_MISO  (via drill 0.3)
  Top 0.254: U2.10 67.37,38.72 v67.97,39.32 | v60.96,47.85 61.27,48.16 61.27,67.06 64.16,69.95 67.21,69.95 70.41,73.15 71.17,73.15 71.39,72.93 IC4.10 71.39,71.71 | SPI2_MISO.TP 32.46,28.35 38.1,33.98 46.18,33.98 56.39,44.2 v60.96,44.2
  Bottom 0.254: v67.97,39.32 65.23,39.32 60.96,43.59 v60.96,44.2 v60.96,47.85
SPI2_MOSI  (via drill 0.3)
  Top 0.254: v61.87,46.63 61.87,67.06 64.31,69.49 67.36,69.49 67.86,69.99 IC4.12 | U2.11 66.9,37.02 66.9,39.32 68.89,41.3 v68.89,41.76 | SPI2_MOSI.TP 32.61,25.3 33.83,26.52 33.83,28.96 38.41,33.53 46.33,33.53 56.24,43.43 v62.64,43.43
  Bottom 0.254: v68.89,41.76 68.58,42.06 64.01,42.06 v62.64,43.43 61.87,44.2 v61.87,46.63
SPI2_SEL_RFTX  (via drill 0.3)
  Top 0.254: v69.19,43.28 69.95,42.52 69.95,40.08 67.87,38 U2.9 | 59.44,47.85 59.44,49.68 60.05,50.29 60.05,67.06 63.86,70.87 66.9,70.87 70.1,74.07 71.48,74.07 72.39,73.15 IC4.8 | SPI2_SEL_RFTX.TP 32,31.39 34.75,31.39 37.95,34.59 46.18,34.59 59.44,47.85 | v62.64,44.5 59.44,47.7 59.44,47.85
  Bottom 0.254: v69.19,43.28 64.01,43.28 62.79,44.5 v62.64,44.5
SWD_RXD
  Top 0.254: U2.16 64.37,38.65 62.48,40.54 60.05,40.54 57,37.49 55.17,35.66 55.02,35.66 SWD_RXD.TP
SWD_TXD
  Top 0.254: U2.17 62.73,34.99 63.4,35.66 63.4,39.01 62.48,39.93 62.18,39.93 60.35,39.93 60.05,39.62 57.91,37.49 SWD_TXD.TP
SWDCLK  (via drill 0.3)
  Top 0.254: U2.49 76.75,27.49 78.64,25.6 v78.64,23.16 | PR0>.3 84.28,17.53 v81.99,19.81
  Bottom 0.254: v81.99,19.81 v78.64,23.16
SWDIO  (via drill 0.3)
  Top 0.254: U2.46 70.87,22.7 70.87,22.09 v73.15,19.81 | v77.11,15.85 77.98,14.99 PR0>.2
  Bottom 0.254: v73.15,19.81 76.81,16.15 v77.11,15.85
USB_DATA_N  (via drill 0.3)
  Top 0.254: U4.1 8.57,21.22 7.01,21.22 | 7.01,21.22 J2.D- | U2.44 69.87,27.07 69.41,27.54 65.53,27.54 v65.53,27.15 | v59.57,24.25 59.27,24.55 50.07,15.34 42.06,15.34 v42.06,14.96 | v7.01,21.95 7.01,21.22
  Bottom 0.254: v65.53,27.15 65.53,27.54 62.26,27.54 59.27,24.55 v59.57,24.25 | v42.06,14.96 42.06,15.34 20.64,15.34 14.04,21.95 v7.01,21.95
USB_DATA_P  (via drill 0.3)
  Top 0.254: U2.45 70.37,27.14 69.58,27.94 65.53,27.94 v65.53,28.32 | v58.69,25.13 58.99,24.83 49.9,15.75 42.06,15.75 v42.06,16.13 | v15.48,21.32 15.32,21.23 14.55,20.46 R27.2 12.69,20.57 U4.2 J2.D+
  Bottom 0.254: v65.53,28.32 65.53,27.94 62.1,27.94 58.99,24.83 v58.69,25.13 | v42.06,16.13 42.06,15.75 20.81,15.75 15.32,21.23 v15.48,21.32
V+STM
  Top 0.254: C9.1 78.39,34.68 C8.1 76.04,34.99 U2.64 73.52,34.99 72.85,35.66 | C10.2 C5.2 65.87,41.02 U2.13 65.87,36.23 66.14,35.97 67.06,35.97 67.67,35.36 67.67,34.29 | C4.1 74.13,39.01 72.85,39.01 71.87,38.04 U2.1 71.93,36.93 71.93,36.58 72.69,35.81 72.85,35.66 | 61.57,27.13 61.93,27.49 U2.32 63.46,27.49 66.75,30.79 67.67,31.7 67.67,33.68 | 61.57,27.13 61.57,25.54 C6.2 | 61.57,27.13 61.57,25.6 61.87,25.3 62.03,25.3 62.79,24.54 62.94,24.38 63.09,24.23 63.09,22.32 B1.2 | C16.2 61.35,38.8 60.35,37.8 60.2,37.64 60.2,34.9 61.11,33.98 U2.19 67.67,33.99 | 67.67,33.99 67.82,33.99 71.18,33.99 72.85,35.66 | 67.67,33.68 67.67,33.99 | 67.67,34.29 67.67,33.99 | 67.67,34.29 67.36,33.98 67.67,33.68 | 67.67,34.29 67.97,33.98 67.67,33.68
VIBRATOR  (via drill 0.3)
  Top 0.254: R25.1 Q3.1 16.24,26.82 v17.37,26.82 | v78.64,27.13 78.64,27.43 78.03,28.04 73.92,28.04 U2.50
  Bottom 0.254: v17.37,26.82 18.29,27.74 25.3,27.74 30.48,32.92 45.72,32.92 59.74,18.9 70.71,18.9 78.64,26.82 v78.64,27.13

## Text on the board
Top: WPLB / Main / V1_0
tPlace: + | - | NRST | 3V3 | SWDCLK | SWDIO | GND
tNames: Charge | Native | FTDI
bNames: WatchPLB Mainboard V1.0 / c by Samuel Hick, HSD 2018 / Made in Austria